# EAGLE design batterylessdice (EAGLE 4.16)
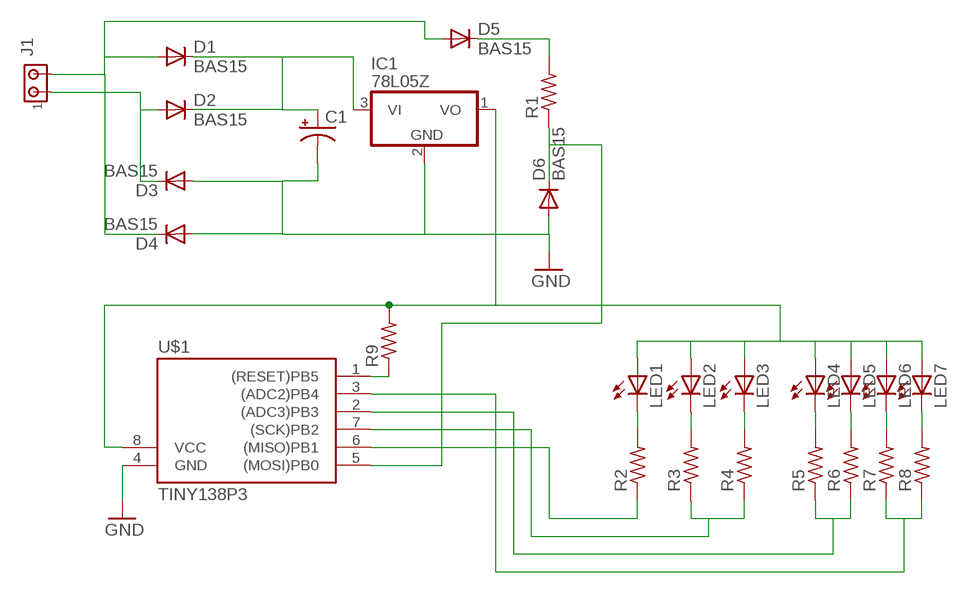
[diagram p0: schematic, sheet 1]

## Parts
C1  CPOL-USB45181B  [B45181B]
D1  BAS15  [DO34-7]
D2  BAS15  [DO34-7]
D3  BAS15  [DO34-7]
D4  BAS15  [DO34-7]
D5  BAS15  [DO34-7]
D6  BAS15  [DO34-7]
IC1  78L05Z  [TO92]
J1  MTA02-100  [10X02MTA]
LED1  LED3MM  [LED3MM]
LED2  LED3MM  [LED3MM]
LED3  LED3MM  [LED3MM]
LED4  LED3MM  [LED3MM]
LED5  LED3MM  [LED3MM]
LED6  LED3MM  [LED3MM]
LED7  LED3MM  [LED3MM]
R1  R-US_0204/5  [0204/5]
R2  R-US_0204/5  [0204/5]
R3  R-US_0204/5  [0204/5]
R4  R-US_0204/5  [0204/5]
R5  R-US_0204/5  [0204/5]
R6  R-US_0204/5  [0204/5]
R7  R-US_0204/5  [0204/5]
R8  R-US_0204/5  [0204/5]
R9  R-US_0204/5  [0204/5]
U$1  TINY138P3  [DIL08]

## Nets
GND: C1.- D3.A D4.A D6.A IC1.2(GND) U$1.4(GND)
N$1: D1.A D4.C D5.A J1.2
N$2: D2.A D3.C J1.1
N$3: C1.+ D1.C D2.C IC1.3(VI)
N$4: R9.1 U$1.1((RESET)PB5)
N$5: R5.1 R6.1 U$1.2((ADC3)PB3)
N$6: LED1.K(C) R2.2
N$7: LED2.K(C) R3.2
N$8: LED3.K(C) R4.2
N$9: LED4.K(C) R5.2
N$10: LED5.K(C) R6.2
N$11: LED6.K(C) R7.2
N$12: LED7.K(C) R8.2
N$13: IC1.1(VO) LED1.A LED2.A LED3.A LED4.A LED5.A LED6.A LED7.A R9.2 U$1.8(VCC)
N$14: D5.C R1.2
N$15: R7.1 R8.1 U$1.3((ADC2)PB4)
N$16: R3.1 R4.1 U$1.7((SCK)PB2)
N$19: R2.1 U$1.6((MISO)PB1)
N$23: D6.C R1.1 U$1.5((MOSI)PB0)

## Library data of the parts
C1 = rcl:CPOL-US: POLARIZED CAPACITOR, American symbol
D1-D6 = diode:BAS15: DIODE high speed
IC1 = linear:78*: Positive VOLTAGE REGULATOR Source: http://cache.national.com/ds/LM/LM78L05.pdf http://www.fairchildsemi.com/ds/LM/LM7805.pdf
J1 = con-amp:MTA02-100: AMP connector
LED1-LED7 = led:LED: LED OSRAM: - CHIPLED LG R971, LG N971, LY N971, LG Q971, LY Q971, LO R971, LY R971 LH N974, LH R974 LS Q976, LO Q976, LY Q976 LO Q996 - Hyper CHIPLED LW Q18S LB Q993, LB Q99A, LB R99A - SideLED LS A670, LO A670, LY A670, LG A670, LP A670 LB A673, LV A673, LT A673, LW A673 LH A674 LY A675 LS A676, LA A676, LO A676, LY A676, LW A676 LS A679, LY A679, LG A679 - Hyper Micro SIDELED® LS Y876, LA Y876, LO Y876, LY Y876 LT Y87S - SmartLED LW L88C, LW L88S LB L89C, LB L89S, LG L890 LS L89K, LO L89K, LY L89K LS L896, LA L896, LO L896, LY L896 - TOPLED LS T670, LO T670, LY T670, LG T670, LP T670 LSG T670, LSP T670, LSY T670, LOP T670, LYG T670 LG T671, LOG T671, LSG T671 LB T673, LV T673, LT T673, LW T673 LH T674 LS T676, LA T676, LO T676, LY T676, LB T676, LH T676, LSB T676, LW T676 LB T67C, LV T67C, LT T67C, LS T67K, LO T67K, LY T67K, LW E67C LS E67B, LA E67B, LO E67B, LY E67B, LB E67C, LV E67C, LT E67C LW T67C LS T679, LY T679, LG T679 LS T770, LO T770, LY T770, LG T770, LP T770 LB T773, LV T773, LT T773, LW T773 LH T774 LS E675, LA E675, LY E675, LS T675 LS T776, LA T776, LO T776, LY T776, LB T776 LHGB T686 LT T68C, LB T68C - Hyper Mini TOPLED® LB M676 - Mini TOPLED Santana® LG M470 LS M47K, LO M47K, LY M47K Source: http://www.osram.convergy.de/
R1-R9 = rcl:R-US_: RESISTOR, American symbol
U$1 = avr-3:TINY13*

## Net classes
0 default: drill 0.381 mm

## Board
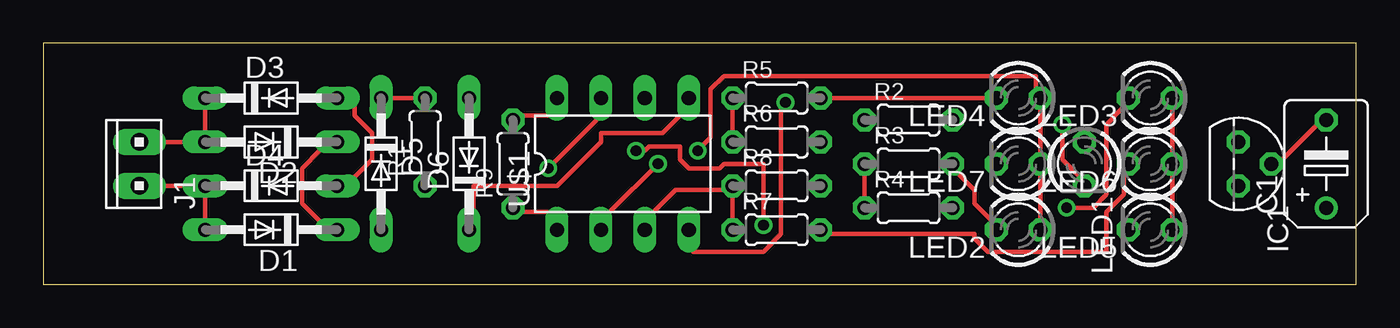
[diagram p1: board, top side]
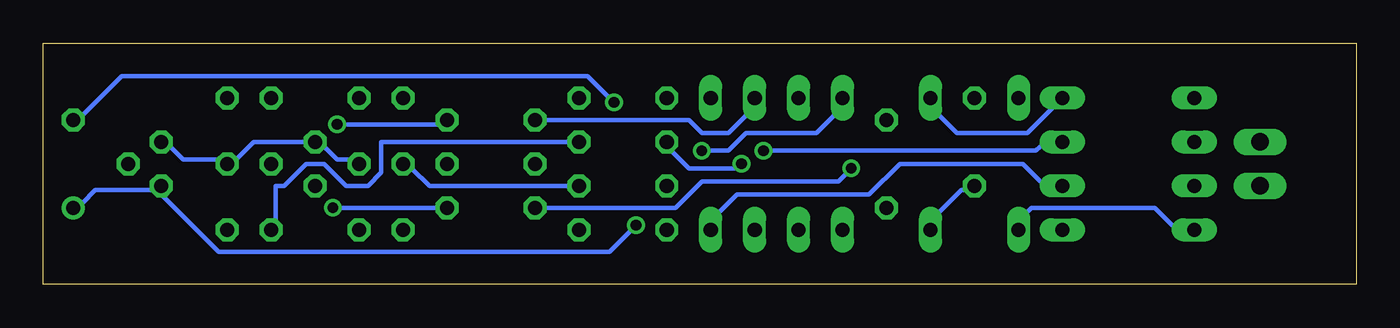
[diagram p2: board, bottom side, seen from below]

Size 75.87 x 13.96 mm. Coordinates in mm from the lower left corner, seen from the top.
Outline: 0,0 75.87,0 75.87,13.96 0,13.96 0,0
Copper layers (1*16): Top 0.035mm / dielectric 1.5mm / Bottom 0.035mm
Design rules "default": minimum track width 10mil, minimum drill 24mil, track to track 8mil, track to pad 8mil, pad to pad 8mil, via to via 8mil, smd to smd 8mil, copper to edge 40mil, drill to drill 8mil, minimum pad ring 10mil, minimum via ring 8mil, stop-mask expansion 4mil, vias tented up to drill 0mil, thermal gap 10mil

### Footprints (pad centres in the part's own frame; a part is rotated, then mirrored left to right if it is on the bottom)
B45181B = drill 0.813 round: + -2.54,0 | drill 0.813 octagon: - 2.54,0
DO34-7 = drill 0.813 long: A 3.81,0; C -3.81,0
TO92 = drill 0.813 octagon: 1 -1.27,0; 2 0,1.905; 3 1.27,0
10X02MTA = drill 1.016 long: 1 1.27,0; 2 -1.27,0
LED3MM = drill 0.813 octagon: A -1.27,0; K 1.27,0
0204/5 = drill 0.813 octagon: 1 -2.54,0; 2 2.54,0
DIL08 = drill 0.813 long: 1 -3.81,-3.81; 2 -1.27,-3.81; 3 1.27,-3.81; 4 3.81,-3.81; 5 3.81,3.81; 6 1.27,3.81; 7 -1.27,3.81; 8 -3.81,3.81

### Placement (x,y rotation side)
C1  74.13,6.98 90 top
D1  13.17,3.17 180 top
D2  13.17,8.25 180 top
D3  13.17,10.79 0 top
D4  13.17,5.71 0 top
D5  19.52,6.98 270 top
D6  24.6,6.98 90 top
IC1  69.05,6.98 270 top
J1  5.55,6.98 90 top
LED1  60.16,6.98 270 top
LED2  56.35,3.17 180 top
LED3  63.97,10.79 180 top
LED4  56.35,10.79 180 top
LED5  63.97,3.17 180 top
LED6  63.97,6.98 180 top
LED7  56.35,6.98 180 top
R1  22.06,8.25 90 top
R2  50,9.52 0 top
R3  50,6.98 0 top
R4  50,4.44 0 top
R5  42.38,10.79 0 top
R6  42.38,8.25 0 top
R7  42.38,3.17 0 top
R8  42.38,5.71 0 top
R9  27.14,6.98 90 top
U$1  33.49,6.98 0 top

### Tracks (layer width: path | path; a pad name or v marks a point on that pad's centre or on a via)
GND  (via drill 0.61)
  Top 0.254: IC1.2 71.59,7.23 73.62,9.27 C1.- | D4.A 18,6.22 19.01,7.23 19.01,8.76 18,9.77 18,10.28 D3.A | v42.89,10.54 42.63,10.28 42.63,2.92 41.62,1.9 37.55,1.9 U$1.4
  Bottom 0.254: D6.A 24.09,9.77 23.08,8.76 19.01,8.76 D3.A | U$1.4 36.79,4.19 35.78,5.2 28.16,5.2 26.38,6.98 19.27,6.98 18.25,5.96 D4.A | v42.89,10.54 44.41,12.06 71.34,12.06 73.62,9.77 C1.-
N$1
  Top 0.254: D1.A D4.C J1.2
  Bottom 0.254: D5.A 19.01,4.19 18.76,4.44 11.65,4.44 10.63,3.42 D1.A
N$2
  Top 0.254: J1.1 D2.A D3.C
N$3  (via drill 0.61)
  Top 0.254: D1.C 15.96,3.68 14.95,4.69 14.95,6.73 15.96,7.74 D2.C | v34.25,7.74 34.76,7.74 35.01,8 36.79,8 36.79,7.23 37.3,6.73 39.08,6.73 39.33,6.98 41.62,6.98 v41.62,3.42
  Bottom 0.254: C1.+ 73.62,4.69 72.86,5.46 69.56,5.46 IC1.3 69.05,5.2 65.75,1.9 43.14,1.9 v41.62,3.42 | v34.25,7.74 18.5,7.74 18.25,8 D2.C
N$4
  Top 0.254: U$1.1 29.17,4.19 27.65,4.19 R9.1
N$5  (via drill 0.61)
  Top 0.254: v35.52,6.98 32.73,4.19 U$1.2 | R6.1 R5.1
  Bottom 0.254: v35.52,6.98 35.78,6.73 38.57,6.73 39.59,7.74 R6.1
N$6  (via drill 0.61)
  Top 0.254: v58.89,9.27 58.89,7.23 59.91,6.22 LED1.K
  Bottom 0.254: v58.89,9.27 53.05,9.27 R2.2
N$7
  Top 0.254: LED2.K 54.83,3.68 53.81,4.69 53.81,5.46 52.79,6.47 R3.2
N$8  (via drill 0.61)
  Top 0.254: v59.14,4.44 60.67,4.44 61.43,5.2 61.43,9.27 62.45,10.28 LED3.K
  Bottom 0.254: R4.2 v59.14,4.44
N$9
  Top 0.254: R5.2 LED4.K
N$10
  Bottom 0.254: LED5.K 62.45,3.68 62.45,5.71 61.94,5.71 60.67,6.98 59.65,6.98 58.38,5.71 57.11,5.71 56.35,6.47 56.35,8.25 R6.2
N$11
  Top 0.254: R7.2 45.43,2.92 53.81,2.92 53.81,2.66 54.57,1.9 61.43,1.9 61.43,4.19 62.45,5.2 62.45,6.47 LED6.K
N$12
  Bottom 0.254: R8.2 53.56,5.71 54.57,6.73 LED7.K
N$13  (via drill 0.61)
  Top 0.254: LED5.A LED6.A LED3.A | R9.2 27.65,9.77 29.17,9.77 U$1.8 | LED2.A LED7.A LED4.A 57.37,11.3 57.37,12.06 39.33,12.06 38.57,11.3 38.57,8.5 v37.81,7.74
  Bottom 0.254: IC1.1 68.54,8 67.78,7.23 65.75,7.23 LED6.A 64.73,7.23 63.72,8.25 LED1.A 59.65,8 58.89,7.23 58.13,7.23 LED7.A | v37.81,7.74 36.28,7.74 35.27,8.76 31.2,8.76 30.19,9.77 U$1.8
N$14
  Top 0.254: D5.C R1.2
N$15
  Top 0.254: U$1.3 35.27,4.19 36.54,5.46 39.33,5.46 R8.1 R7.1
N$16  (via drill 0.61)
  Top 0.254: R4.1 R3.1 | v29.17,6.73 31.97,9.52 U$1.7
  Bottom 0.254: v29.17,6.73 29.93,5.96 37.81,5.96 39.33,4.44 R4.1
N$19
  Bottom 0.254: R2.1 38.57,9.52 37.81,8.76 36.28,8.76 35.27,9.77 U$1.6
N$23
  Top 0.254: U$1.5 36.79,9.77 35.78,8.76 32.22,8.76 32.22,8.25 29.68,5.71 24.85,5.71 24.85,4.44 D6.C
  Bottom 0.254: D6.C 24.09,4.19 22.82,5.46 22.57,5.46 R1.1